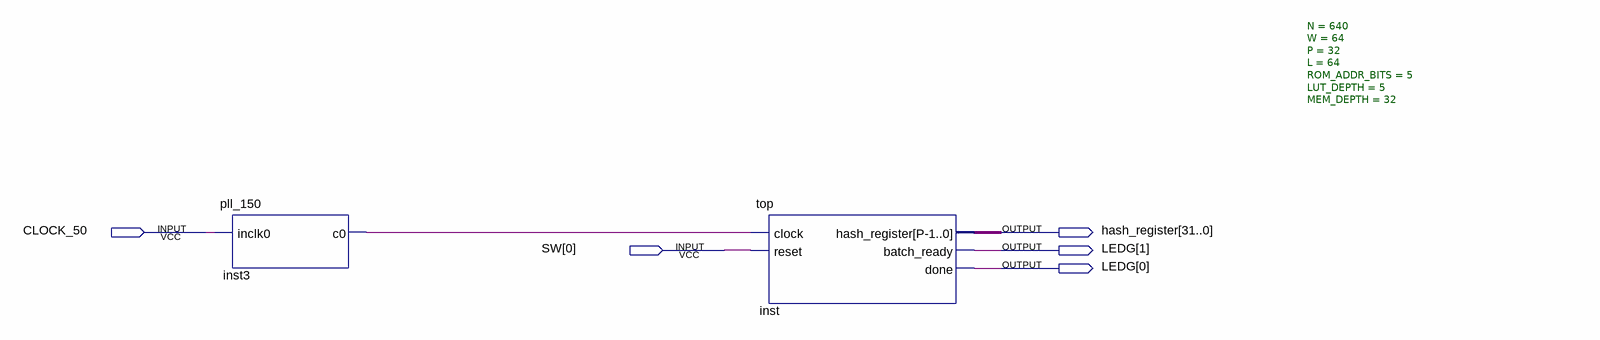
[diagram p0: schematic sheet]
// Quartus schematic lab-iv-privacy-amplification.bdf as structural Verilog: 2 symbols, 5 pins
module \lab-iv-privacy-amplification  (
  input  CLOCK_50,
  input  [0:0] SW,
  output [31:0] hash_register,
  output [1:0] LEDG
);

  wire inst3_c0;

  pll_150 inst3 (.inclk0(CLOCK_50), .c0(inst3_c0));
  top #(.N(640), .W(64), .P(32), .L(64), .ROM_ADDR_BITS(5), .LUT_DEPTH(5), .MEM_DEPTH(32)) inst (
    .clock(inst3_c0), .reset(SW[0]), .hash_register(hash_register), .batch_ready(LEDG[1]), .done(LEDG[0]));
endmodule
